# EAGLE design W600A (EAGLE 6.6.0)
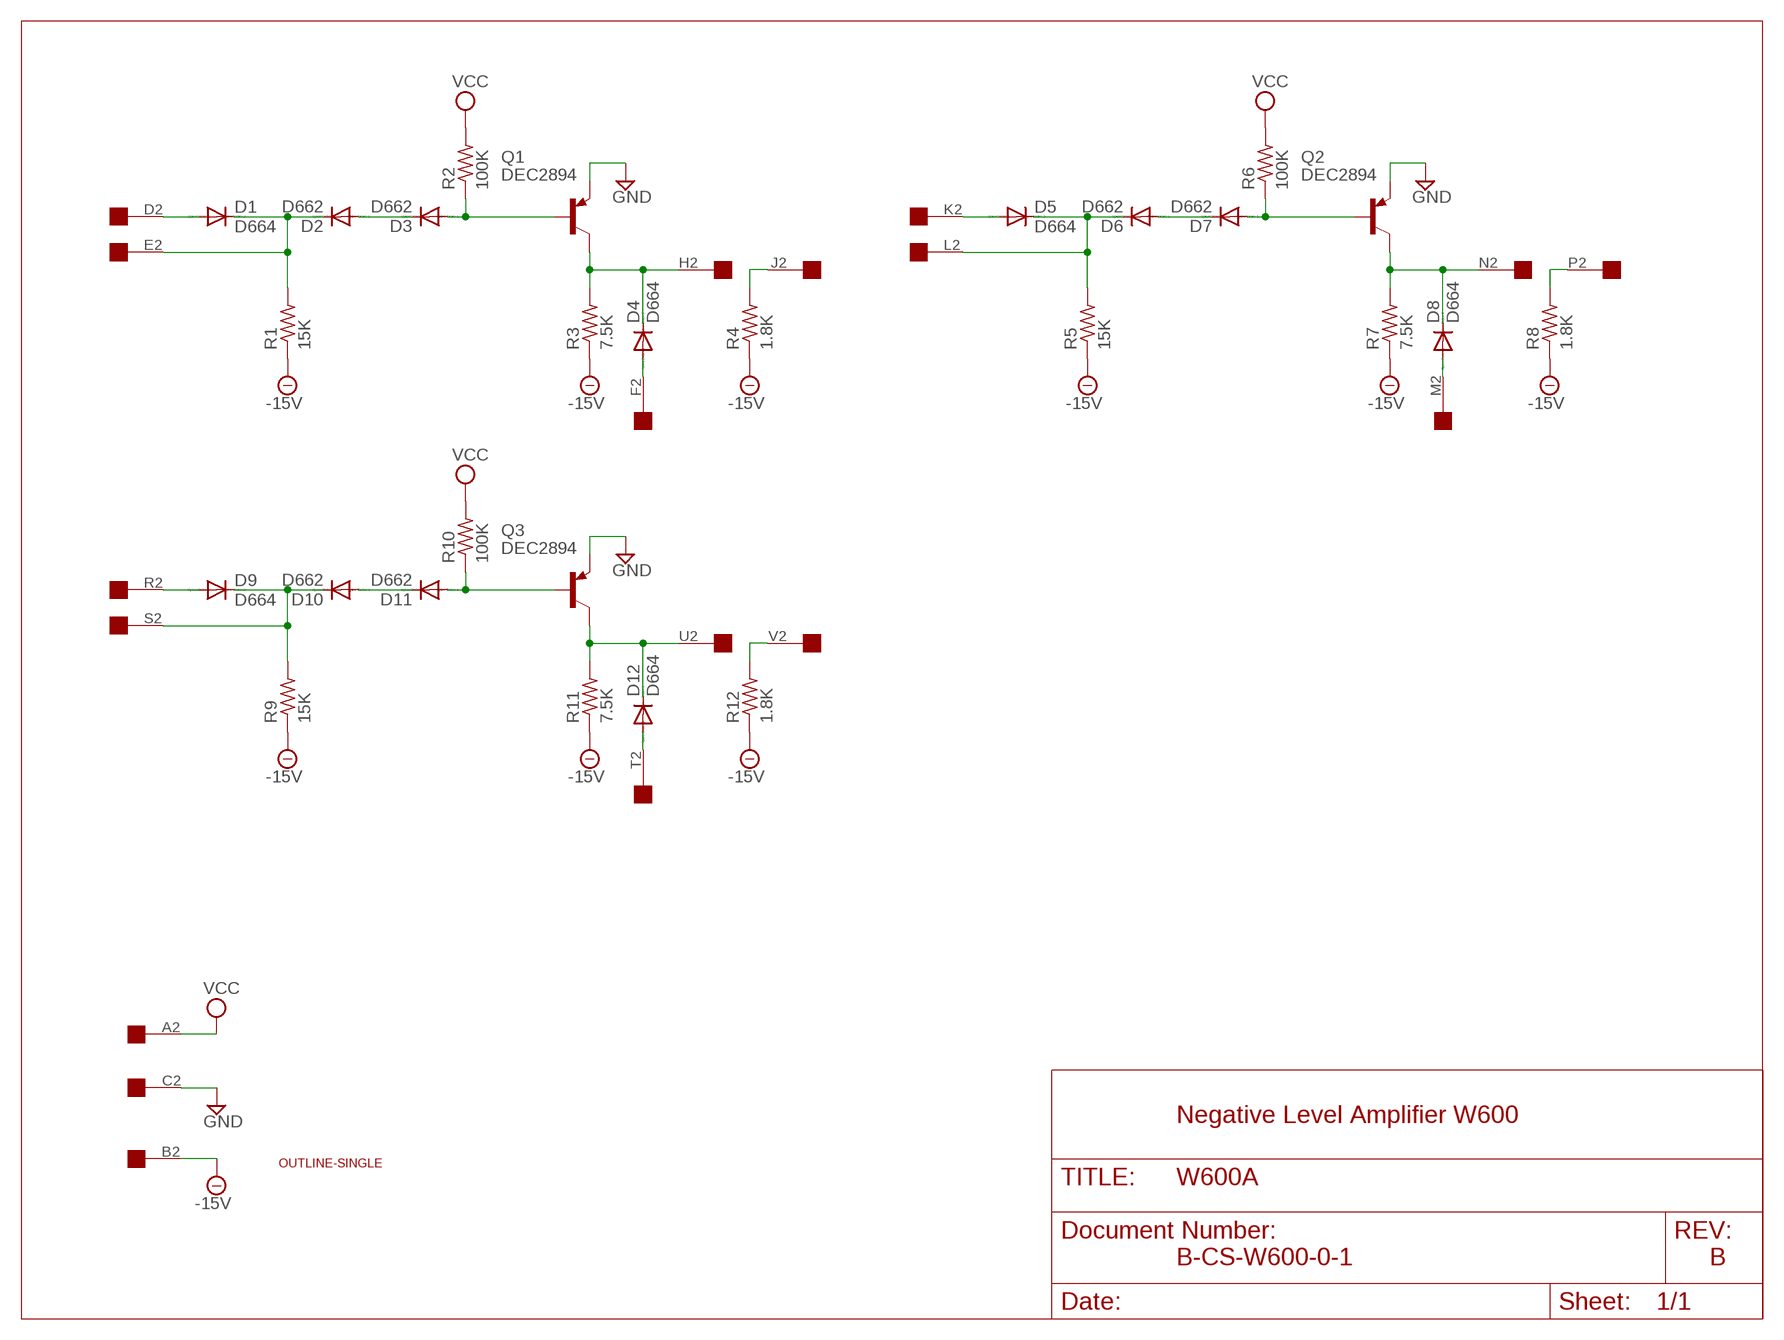
[diagram p0: schematic, sheet 1]

## Parts
D1  D664  DIODE-DO35-10  [DO35-10]
D2  D662  DIODE-DO35-10  [DO35-10]
D3  D662  DIODE-DO35-10  [DO35-10]
D4  D664  DIODE-DO35-10  [DO35-10]
D5  D664  DIODE-DO35-10  [DO35-10]
D6  D662  DIODE-DO35-10  [DO35-10]
D7  D662  DIODE-DO35-10  [DO35-10]
D8  D664  DIODE-DO35-10  [DO35-10]
D9  D664  DIODE-DO35-10  [DO35-10]
D10  D662  DIODE-DO35-10  [DO35-10]
D11  D662  DIODE-DO35-10  [DO35-10]
D12  D664  DIODE-DO35-10  [DO35-10]
Q1  DEC2894  -PNP-TO5  [TO5]
Q2  DEC2894  -PNP-TO5  [TO5]
Q3  DEC2894  -PNP-TO5  [TO5]
R1  15K  R-US_0207/10  [0207/10]
R2  100K  R-US_0207/10  [0207/10]
R3  7.5K  R-US_0207/10  [0207/10]
R4  1.8K  R-US_0207/10  [0207/10]
R5  15K  R-US_0207/10  [0207/10]
R6  100K  R-US_0207/10  [0207/10]
R7  7.5K  R-US_0207/10  [0207/10]
R8  1.8K  R-US_0207/10  [0207/10]
R9  15K  R-US_0207/10  [0207/10]
R10  100K  R-US_0207/10  [0207/10]
R11  7.5K  R-US_0207/10  [0207/10]
R12  1.8K  R-US_0207/10  [0207/10]
U$1  OUTLINE-SINGLE  [SINGLE]
U$2  EDGE-1  [EDGE-CON1]

## Nets
-15V: R1.1 R3.1 R4.1 R5.1 R7.1 R8.1 R9.1 R11.1 R12.1 U$2.B2
GND: Q1.1(E) Q2.1(E) Q3.1(E) U$2.C2
N$1: D3.A Q1.2(B) R2.1
N$2: D2.A D3.C
N$3: D1.C D2.C R1.2 U$2.E2
N$4: D1.A U$2.D2
N$5: D4.C Q1.3(C) R3.2 U$2.H2
N$6: R4.2 U$2.J2
N$7: D7.A Q2.2(B) R6.1
N$8: D6.A D7.C
N$9: D5.C D6.C R5.2 U$2.L2
N$10: D5.A U$2.K2
N$11: D8.C Q2.3(C) R7.2 U$2.N2
N$12: R8.2 U$2.P2
N$13: D11.A Q3.2(B) R10.1
N$14: D10.A D11.C
N$15: D9.C D10.C R9.2 U$2.S2
N$16: D9.A U$2.R2
N$17: D12.C Q3.3(C) R11.2 U$2.U2
N$18: R12.2 U$2.V2
N$19: D12.A U$2.T2
N$25: D4.A U$2.F2
N$26: D8.A U$2.M2
VCC: R2.2 R6.2 R10.2 U$2.A2

## Notes on the sheet
- Negative Level Amplifier W600
- B-CS-W600-0-1 | B

## Library data of the parts
D1-D12 = diode:DIODE-: DIODE
Q1-Q3 = transistor:*-PNP-: PNP Transistror
R1-R12 = rcl:R-US_: RESISTOR, American symbol
U$1 = dec-con:OUTLINE-*: Board outlines for DEC boards.
U$2 = dec-con:EDGE-1: Single-Sided DEC Edge Connector -- (side 2)

## Net classes
0 default: width 0.813 mm

## Board
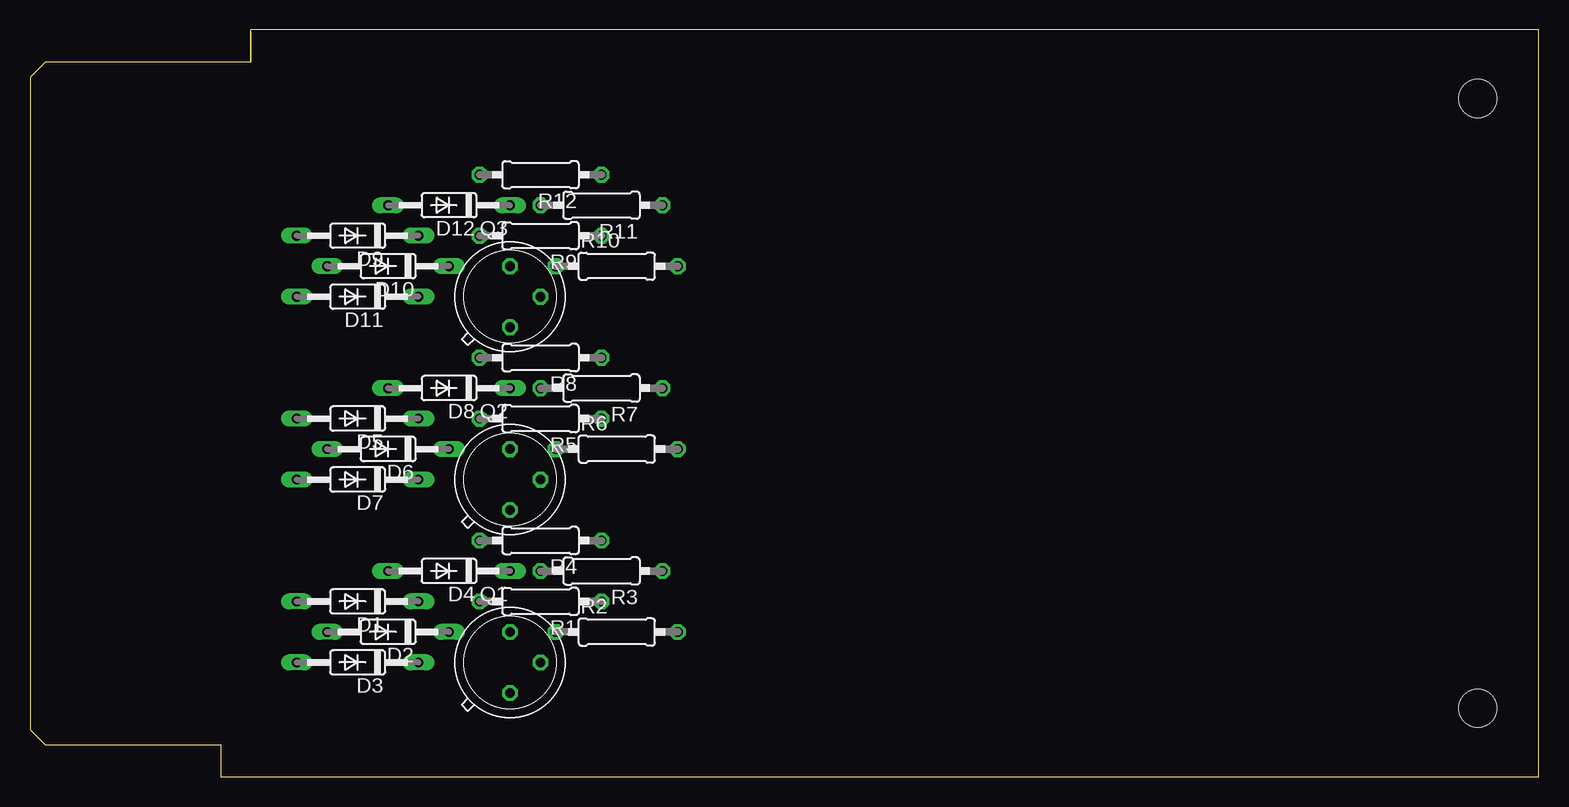
[diagram p1: board, top side]
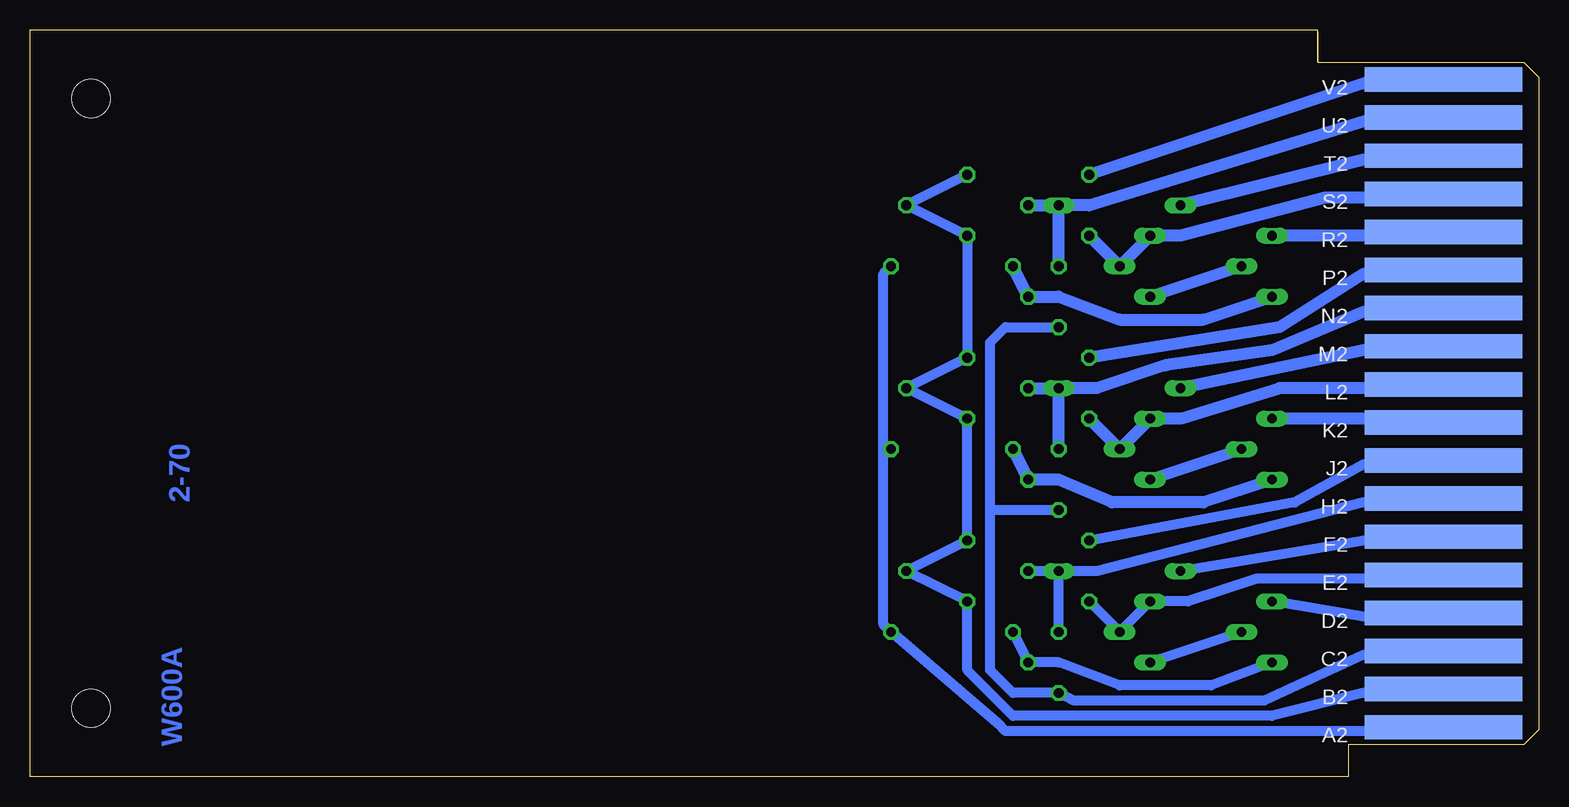
[diagram p2: board, bottom side, seen from below]

Size 125.73 x 62.23 mm. Coordinates in mm from the lower left corner, seen from the top.
Copper layers (1+16): Top 0.035mm / dielectric 1.5mm / Bottom 0.035mm
Design rules "16mils": minimum track width 16mil, minimum drill 32mil, track to track 15mil, track to pad 10mil, pad to pad 10mil, via to via 10mil, smd to smd 10mil, copper to edge 13mil, drill to drill 10mil, minimum pad ring 10mil, minimum via ring 8mil, stop-mask expansion 0mil, vias tented up to drill 0mil, thermal gap 10mil

### Footprints (pad centres in the part's own frame; a part is rotated, then mirrored left to right if it is on the bottom)
DO35-10 = drill 0.813 long: A 5.08,0; C -5.08,0
TO5 = drill 0.813 octagon: 1 0,-2.54; 2 2.54,0; 3 0,2.54
0207/10 = drill 0.813 octagon: 1 -5.08,0; 2 5.08,0
SINGLE = hole 3.175: 120.65,56.515; 120.65,5.715
EDGE-CON1 = smd 13.106 x 2.032 bottom: A2 7.938,4.128; B2 7.938,7.303; C2 7.938,10.477; D2 7.938,13.652; E2 7.938,16.828; F2 7.938,20.003; H2 7.938,23.177; J2 7.938,26.352; K2 7.938,29.527; L2 7.938,32.703; M2 7.938,35.877; N2 7.938,39.053; P2 7.938,42.227; R2 7.938,45.403; S2 7.938,48.578; T2 7.938,51.752; U2 7.938,54.928; V2 7.938,58.102

### Placement (x,y rotation side)
D1  27.31,14.61 180 top
D2  29.85,12.06 180 top
D3  27.31,9.53 180 top
D4  34.93,17.14 180 top
D5  27.31,29.84 180 top
D6  29.85,27.3 180 top
D7  27.31,24.77 180 top
D8  34.93,32.38 180 top
D9  27.31,45.09 180 top
D10  29.85,42.55 180 top
D11  27.31,40.01 180 top
D12  34.93,47.62 180 top
Q1  40.01,9.53 0 top
Q2  40.01,24.77 0 top
Q3  40.01,40.01 0 top
R1  42.55,14.61 180 top
R2  48.9,12.06 0 top
R3  47.63,17.14 180 top
R4  42.55,19.68 180 top
R5  42.55,29.84 180 top
R6  48.9,27.3 0 top
R7  47.63,32.38 180 top
R8  42.55,34.92 180 top
R9  42.55,45.09 180 top
R10  48.9,42.55 0 top
R11  47.63,47.62 180 top
R12  42.55,50.16 180 top
U$1  0,0 0 top
U$2  0,0 0 top

### Tracks (layer width: path | path; a pad name or v marks a point on that pad's centre or on a via)
-15V
  Bottom 0.813: U$2.B2 8.89,6.99 14.61,6.99 22.23,5.08 43.82,5.08 47.63,8.89 R1.1 R3.1 R4.1 R5.1 R7.1 R8.1 R9.1 R11.1 R12.1
GND
  Bottom 0.813: U$2.C2 8.89,10.16 14.61,10.16 22.86,6.35 38.74,6.35 Q1.1 43.82,6.99 45.72,8.89 45.72,22.23 | 45.72,22.23 45.72,36.2 44.45,37.47 Q3.1 | Q2.1 45.72,22.23
N$1
  Bottom 0.813: R2.1 Q1.2 40.01,9.53 34.93,7.62 27.31,7.62 D3.A
N$2
  Bottom 0.813: D2.A D3.C
N$3
  Bottom 0.813: R1.2 D2.C D1.C 29.21,14.61 23.5,16.51 8.89,16.51 U$2.E2
N$4
  Bottom 0.813: U$2.D2 8.89,13.34 14.61,13.34 D1.A
N$5
  Bottom 0.813: Q1.3 D4.C | D4.C 40.64,17.14 R3.2 | U$2.H2 8.89,22.86 14.61,22.86 36.83,17.14 D4.C
N$6
  Bottom 0.813: U$2.J2 8.89,26.04 14.61,26.04 20.32,22.86 R4.2
N$7
  Bottom 1.016: D7.A 27.94,22.86 35.56,22.86 40.01,24.77 Q2.2 R6.1
N$8
  Bottom 1.016: D6.A D7.C
N$9
  Bottom 1.016: R5.2 D6.C D5.C 29.85,29.84 21.59,32.38 8.89,32.38 U$2.L2
N$10
  Bottom 1.016: U$2.K2 8.26,29.84 D5.A
N$11
  Bottom 1.016: Q2.3 D8.C | R7.2 D8.C | U$2.N2 9.53,38.73 14.61,38.73 22.23,35.56 31.12,34.29 36.83,32.38 D8.C
N$12
  Bottom 1.016: U$2.P2 8.89,41.91 14.61,41.91 21.59,37.47 R8.2
N$13
  Bottom 1.016: D11.A 27.94,38.1 34.93,38.1 40.01,40.01 Q3.2 R10.1
N$14
  Bottom 1.016: D10.A D11.C
N$15
  Bottom 1.016: U$2.S2 8.89,48.26 17.78,48.26 29.85,45.09 D9.C D10.C R9.2
N$16
  Bottom 1.016: U$2.R2 8.26,45.09 D9.A
N$17
  Bottom 1.016: R11.2 D12.C | Q3.3 D12.C | U$2.U2 8.89,54.61 14.61,54.61 37.47,47.62 D12.C
N$18
  Bottom 1.016: U$2.V2 8.89,57.78 14.61,57.78 R12.2
N$19
  Bottom 1.016: U$2.T2 8.89,51.44 14.61,51.44 D12.A
N$25
  Bottom 0.813: U$2.F2 8.89,19.68 14.61,19.68 D4.A
N$26
  Bottom 1.016: U$2.M2 8.89,35.56 14.61,35.56 D8.A
VCC
  Bottom 0.813: U$2.A2 8.89,3.81 44.45,3.81 45.09,4.45 R2.2 54.61,12.7 54.61,27.3 | 54.61,27.3 54.61,41.91 R10.2 | 54.61,27.3 R6.2

### Text on the board
Bottom: 2-70 | W600A
200bmp: C:/Users/Vince/Documents/eagle/projects/DEC/Wxxx/W600/W600Abackfb.bmp